# Altium project F407ULPI&externalDAC.PrjPcb
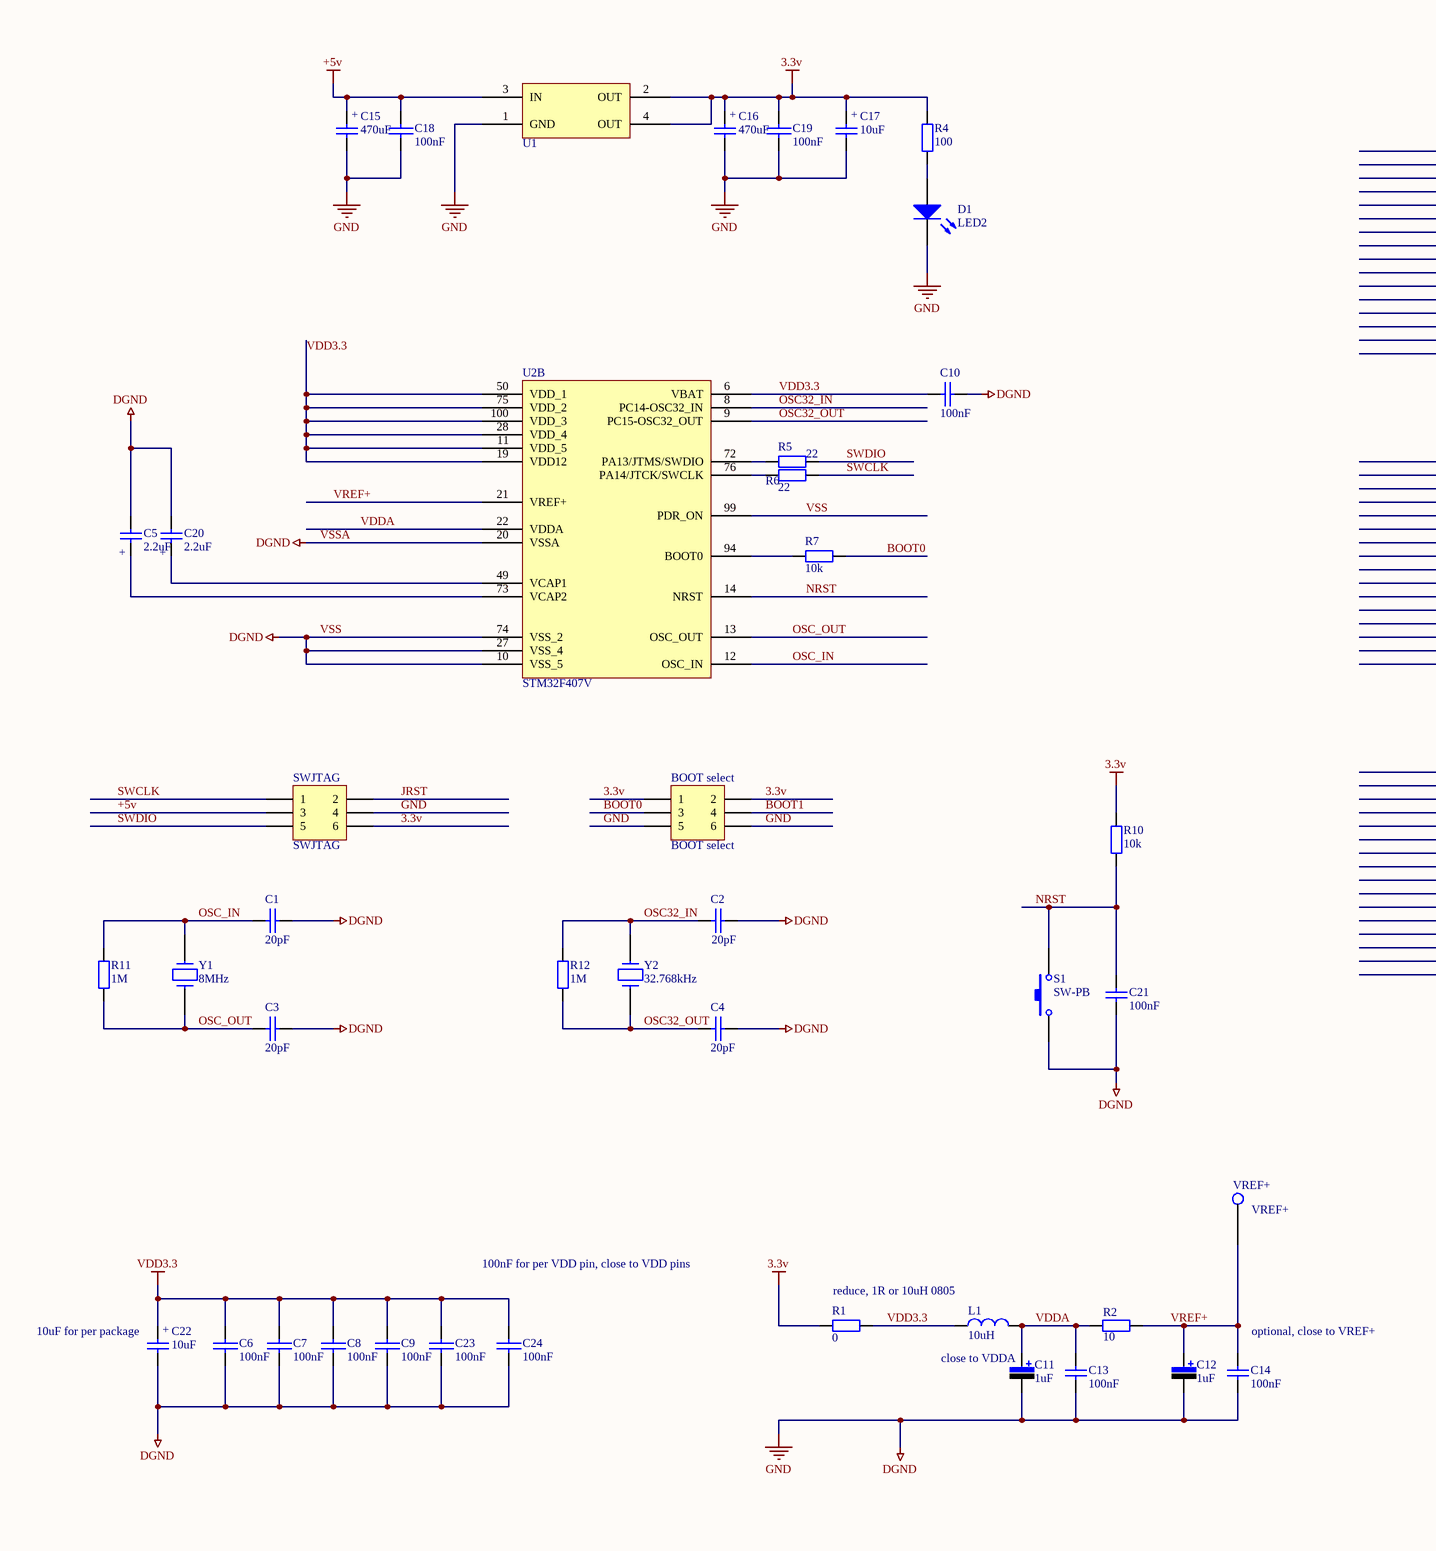
[diagram p0: F407ULPI&externalDAC.SchDoc, left]
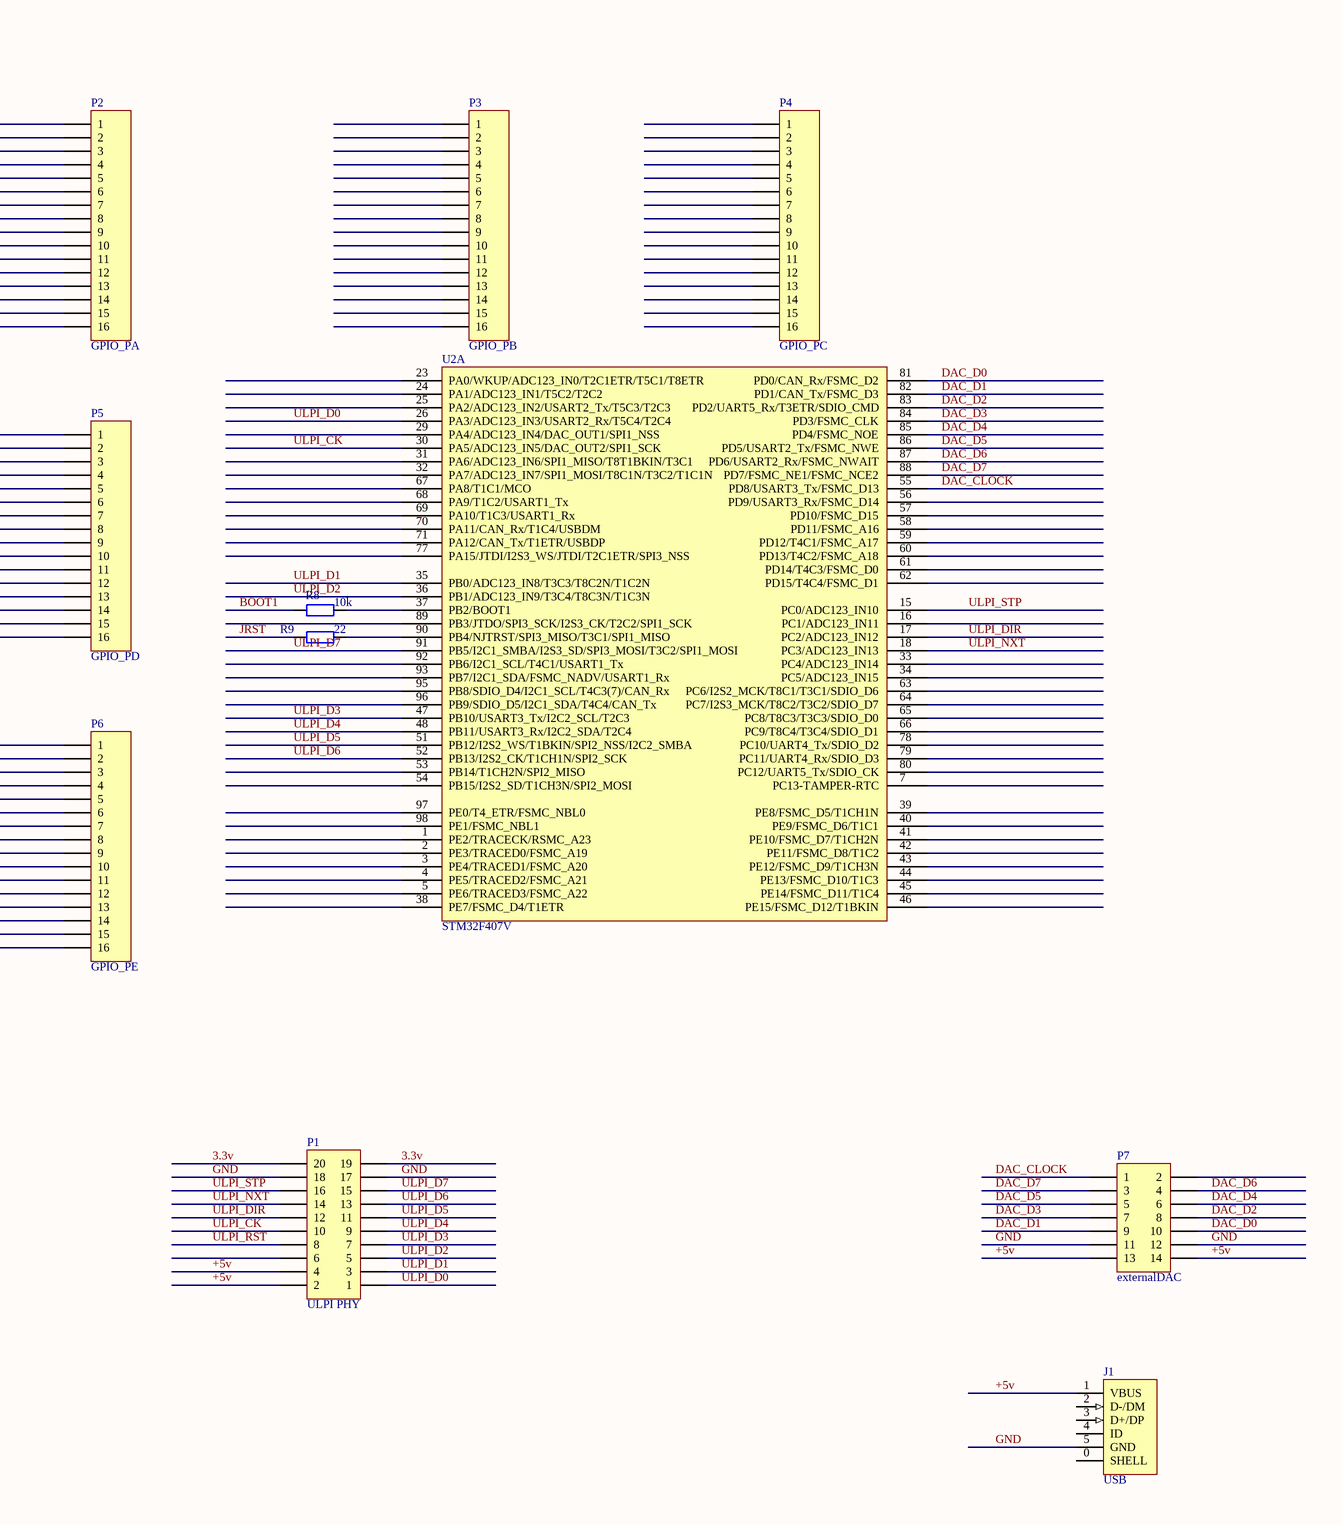
[diagram p1: F407ULPI&externalDAC.SchDoc, right]
1 sheet, 53 parts. Net scope: global (net labels, ports and power ports of the same name join across sheets).
Board file: F407ULPI&externalDAC.PcbDoc

## Sheet F407ULPI&externalDAC.SchDoc
size A2; PageSetup: Record=PageOptions|CenterHorizontal=True|CenterVertical=True|PrintScale=1.00|XCorrection=1.00|YCorrection=1.00|PrintKind=1|BorderSize=5000000|LeftOffset=0|BottomOffset=0|Orientation=1|PaperLength=1000|PaperWidth=1000|Scale=100|PaperSource=7|PrintQuality=-3|MediaType=1|DitherType=10|PrintScaleMode=1|PaperKind=A4|PaperIndex=9

### Parts
BOOT_select  BOOT select  [HDR2X3_CEN]
C1  value 20pF  [CAP-0603]  (hidden comment: cap smd)
C2  value 20pF  [CAP-0603]  (hidden comment: cap smd)
C3  value 20pF  [CAP-0603]  (hidden comment: cap smd)
C4  value 20pF  [CAP-0603]  (hidden comment: cap smd)
C5  value 2.2uF  [CAP-3216]  (hidden comment: Cap)
C6  value 100nF  [CAP-0603]  (hidden comment: cap smd)
C7  value 100nF  [CAP-0603]  (hidden comment: cap smd)
C8  value 100nF  [CAP-0603]  (hidden comment: cap smd)
C9  value 100nF  [CAP-0603]  (hidden comment: cap smd)
C10  value 100nF  [CAP-0603]  (hidden comment: cap smd)
C11  value 1uF  [CAP-3216]  (hidden comment: Cap Pol)
C12  value 1uF  [CAP-3216]  (hidden comment: Cap Pol)
C13  value 100nF  [CAP-0603]  (hidden comment: Cap)
C14  value 100nF  [CAP-0603]  (hidden comment: Cap)
C15  value 470uF  [CAP-7343]  (hidden comment: Cap)
C16  value 470uF  [CAP-7343]  (hidden comment: Cap)
C17  value 10uF  [CAP-3216]  (hidden comment: Cap)
C18  value 100nF  [CAP-0603]  (hidden comment: cap smd)
C19  value 100nF  [CAP-0603]  (hidden comment: cap smd)
C20  value 2.2uF  [CAP-3216]  (hidden comment: Cap)
C21  value 100nF  [CAP-0603]  (hidden comment: Cap)
C22  value 10uF  [CAP-3216]  (hidden comment: Cap)
C23  value 100nF  [CAP-0603]  (hidden comment: cap smd)
C24  value 100nF  [CAP-0603]  (hidden comment: cap smd)
D1  LED2  [LED_0805]
J1  USB  [microUSB]
L1  value 10uH  [0805-1]  (hidden comment: Inductor)
P1  ULPI PHY  [HDR2X10]
P2  GPIO_PA  [HDR1X16]
P3  GPIO_PB  [HDR1X16]
P4  GPIO_PC  [HDR1X16]
P5  GPIO_PD  [HDR1X16]
P6  GPIO_PE  [HDR1X16]
P7  externalDAC  [HDR2X7]
R1  value 0  [CAP-0603]  (hidden comment: RES1)
R2  value 10  [CAP-0603]  (hidden comment: Res1)
R4  value 100  [CAP-0603]  (hidden comment: RES1)
R5  value 22  [CAP-0603]  (hidden comment: RES1)
R6  value 22  [CAP-0603]  (hidden comment: RES1)
R7  value 10k  [CAP-0603]  (hidden comment: RES1)
R8  value 10k  [CAP-0603]  (hidden comment: RES1)
R9  value 22  [CAP-0603]  (hidden comment: RES1)
R10  value 10k  [R2012[0805]]  (hidden comment: RES1)
R11  value 1M  [R2012[0805]]  (hidden comment: RES1)
R12  value 1M  [R2012[0805]]  (hidden comment: RES1)
S1  SW-PB  [SPST-2]
SWJTAG  SWJTAG  [HDR2X3_CEN]
U1  1117-3.3  [SOT223]  (value not drawn)
U2  STM32F407V  [LQFP-100_M]  (parts A,B of 2)
VREF+  VREF+  [HDR1*1]
Y1  8MHz  [Crystal]
Y2  32.768kHz  [Crystal]

### Nets
3.3v: BOOT_select.1 BOOT_select.2 C16.1(+) C17.1(+) C19.1 P1.19 P1.20 R1.1 R4.2 R10.2 SWJTAG.6 U1.2(OUT) U1.4(OUT)
+5v: C15.1(+) C18.1 J1.1(VBUS) P1.2 P1.4 P7.13 P7.14 SWJTAG.3 U1.3(IN)
GND: BOOT_select.5 BOOT_select.6 C1.2 C2.2 C3.1 C4.1 C5.2(-) C6.2 C7.2 C8.2 C9.2 C10.1 C11.2 C12.2 C13.1 C14.1 C15.2(-) C16.2(-) C17.2(-) C18.2 C19.2 C20.2(-) C21.1 C22.2(-) C23.2 C24.2 D1.2(K) J1.5(GND) P1.17 P1.18 P7.11 P7.12 S1.1 SWJTAG.4 U1.1(GND) U2.10(VSS_5) U2.20(VSSA) U2.27(VSS_4) U2.74(VSS_2) U2.99(PDR_ON)  [also labelled DGND, VSS, VSSA]
VDD3.3: C6.1 C7.1 C8.1 C9.1 C10.2 C22.1(+) C23.1 C24.1 L1.1 R1.2 U2.6(VBAT) U2.11(VDD_5) U2.19(VDD12) U2.28(VDD_4) U2.50(VDD_1) U2.75(VDD_2) U2.100(VDD_3)
BOOT0: BOOT_select.3 R7.2
BOOT1: BOOT_select.4 R8.1
DAC_CLOCK: P7.1 U2.55(PD8/USART3_Tx/FSMC_D13)
DAC_D0: P7.10 U2.81(PD0/CAN_Rx/FSMC_D2)
DAC_D1: P7.9 U2.82(PD1/CAN_Tx/FSMC_D3)
DAC_D2: P7.8 U2.83(PD2/UART5_Rx/T3ETR/SDIO_CMD)
DAC_D3: P7.7 U2.84(PD3/FSMC_CLK)
DAC_D4: P7.6 U2.85(PD4/FSMC_NOE)
DAC_D5: P7.5 U2.86(PD5/USART2_Tx/FSMC_NWE)
DAC_D6: P7.4 U2.87(PD6/USART2_Rx/FSMC_NWAIT)
DAC_D7: P7.3 U2.88(PD7/FSMC_NE1/FSMC_NCE2)
JRST: R9.1 SWJTAG.2
NRST: C21.2 R10.1 S1.2 U2.14(NRST)
OSC32_IN: C2.1 R12.2 U2.8(PC14-OSC32_IN) Y2.2
OSC32_OUT: C4.2 R12.1 U2.9(PC15-OSC32_OUT) Y2.1
OSC_IN: C1.1 R11.2 U2.12(OSC_IN) Y1.2
OSC_OUT: C3.2 R11.1 U2.13(OSC_OUT) Y1.1
SWCLK: R6.2 SWJTAG.1
SWDIO: R5.2 SWJTAG.5
ULPI_CK: P1.10 U2.30(PA5/ADC123_IN5/DAC_OUT2/SPI1_SCK)
ULPI_D0: P1.1 U2.26(PA3/ADC123_IN3/USART2_Rx/T5C4/T2C4)
ULPI_D1: P1.3 U2.35(PB0/ADC123_IN8/T3C3/T8C2N/T1C2N)
ULPI_D2: P1.5 U2.36(PB1/ADC123_IN9/T3C4/T8C3N/T1C3N)
ULPI_D3: P1.7 U2.47(PB10/USART3_Tx/I2C2_SCL/T2C3)
ULPI_D4: P1.9 U2.48(PB11/USART3_Rx/I2C2_SDA/T2C4)
ULPI_D5: P1.11 U2.51(PB12/I2S2_WS/T1BKIN/SPI2_NSS/I2C2_SMBA)
ULPI_D6: P1.13 U2.52(PB13/I2S2_CK/T1CH1N/SPI2_SCK)
ULPI_D7: P1.15 U2.91(PB5/I2C1_SMBA/I2S3_SD/SPI3_MOSI/T3C2/SPI1_MOSI)
ULPI_DIR: P1.12 U2.17(PC2/ADC123_IN12)
ULPI_NXT: P1.14 U2.18(PC3/ADC123_IN13)
ULPI_RST: P1.8
ULPI_STP: P1.16 U2.15(PC0/ADC123_IN10)
VDDA: C11.1 C13.2 L1.2 R2.1 U2.22(VDDA)
VREF+: C12.1 C14.2 R2.2 U2.21(VREF+) VREF+.1(p)
NetC5_1: C5.1(+) U2.73(VCAP2)
NetC20_1: C20.1(+) U2.49(VCAP1)
NetD1_1: D1.1(A) R4.1
NetR5_1: R5.1 U2.72(PA13/JTMS/SWDIO)
NetR6_1: R6.1 U2.76(PA14/JTCK/SWCLK)
NetR7_1: R7.1 U2.94(BOOT0)
NetR8_2: R8.2 U2.37(PB2/BOOT1)
NetR9_2: R9.2 U2.90(PB4/NJTRST/SPI3_MISO/T3C1/SPI1_MISO)

Not connected (* = marked no-connect by the designer): J1 0(SHELL) 2(D-/DM) 3(D+/DP) 4(ID); P1 6; P2 1 2 3 4 5 6 7 8 9 10 11 12 13 14 15 16; P3 1 2 3 4 5 6 7 8 9 10 11 12 13 14 15 16; P4 1 2 3 4 5 6 7 8 9 10 11 12 13 14 15 16; P5 1 2 3 4 5 6 7 8 9 10 11 12 13 14 15 16; P6 1 2 3 4 5 6 7 8 9 10 11 12 13 14 15 16; P7 2; U2 1(PE2/TRACECK/RSMC_A23) 2(PE3/TRACED0/FSMC_A19) 3(PE4/TRACED1/FSMC_A20) 4(PE5/TRACED2/FSMC_A21) 5(PE6/TRACED3/FSMC_A22) 7(PC13-TAMPER-RTC) 16(PC1/ADC123_IN11) 23(PA0/WKUP/ADC123_IN0/T2C1ETR/T5C1/T8ETR) 24(PA1/ADC123_IN1/T5C2/T2C2) 25(PA2/ADC123_IN2/USART2_Tx/T5C3/T2C3) 29(PA4/ADC123_IN4/DAC_OUT1/SPI1_NSS) 31(PA6/ADC123_IN6/SPI1_MISO/T8T1BKIN/T3C1) 32(PA7/ADC123_IN7/SPI1_MOSI/T8C1N/T3C2/T1C1N) 33(PC4/ADC123_IN14) 34(PC5/ADC123_IN15) 38(PE7/FSMC_D4/T1ETR) 39(PE8/FSMC_D5/T1CH1N) 40(PE9/FSMC_D6/T1C1) 41(PE10/FSMC_D7/T1CH2N) 42(PE11/FSMC_D8/T1C2) 43(PE12/FSMC_D9/T1CH3N) 44(PE13/FSMC_D10/T1C3) 45(PE14/FSMC_D11/T1C4) 46(PE15/FSMC_D12/T1BKIN) 53(PB14/T1CH2N/SPI2_MISO) 54(PB15/I2S2_SD/T1CH3N/SPI2_MOSI) 56(PD9/USART3_Rx/FSMC_D14) 57(PD10/FSMC_D15) 58(PD11/FSMC_A16) 59(PD12/T4C1/FSMC_A17) 60(PD13/T4C2/FSMC_A18) 61(PD14/T4C3/FSMC_D0) 62(PD15/T4C4/FSMC_D1) 63(PC6/I2S2_MCK/T8C1/T3C1/SDIO_D6) 64(PC7/I2S3_MCK/T8C2/T3C2/SDIO_D7) 65(PC8/T8C3/T3C3/SDIO_D0) 66(PC9/T8C4/T3C4/SDIO_D1) 67(PA8/T1C1/MCO) 68(PA9/T1C2/USART1_Tx) 69(PA10/T1C3/USART1_Rx) 70(PA11/CAN_Rx/T1C4/USBDM) 71(PA12/CAN_Tx/T1ETR/USBDP) 77(PA15/JTDI/I2S3_WS/JTDI/T2C1ETR/SPI3_NSS) 78(PC10/UART4_Tx/SDIO_D2) 79(PC11/UART4_Rx/SDIO_D3) 80(PC12/UART5_Tx/SDIO_CK) 89(PB3/JTDO/SPI3_SCK/I2S3_CK/T2C2/SPI1_SCK) 92(PB6/I2C1_SCL/T4C1/USART1_Tx) 93(PB7/I2C1_SDA/FSMC_NADV/USART1_Rx) 95(PB8/SDIO_D4/I2C1_SCL/T4C3(7)/CAN_Rx) 96(PB9/SDIO_D5/I2C1_SDA/T4C4/CAN_Tx) 97(PE0/T4_ETR/FSMC_NBL0) 98(PE1/FSMC_NBL1)

### Notes on the sheet
- 100nF for per VDD pin, close to VDD pins
- reduce, 1R or 10uH 0805
- (near C22) 10uF for per package
- (near C11) close to VDDA
- (near C14) optional, close to VREF+

### Library data of the parts
BOOT_select SWJTAG = Header 3X2: Header, 3-Pin, Dual row; LatestRevisionDate: 17-Jul-2002; LatestRevisionNote: Re-released for DXP Platform.; Publisher: Altium Limited
C1-C4 C6-C10 C18 C19 C23 C24 = CAP: 贴片无极性电容
C5 C15-C17 C20 C22 = Cap Pol S: 贴片极性电容
C11 C12 = Cap Pol: 极性电解电容; Vol: 16V; Published: 8-Jun-2000; LatestRevisionDate: 17-Jul-2002; LatestRevisionNote: Re-released for DXP Platform.; PackageReference: RB7.6-15; Publisher: Altium Limited
C13 C14 C21 = Cap: 无极性电容; Published: 8-Jun-2000; LatestRevisionDate: 17-Jul-2002; LatestRevisionNote: Re-released for DXP Platform.; PackageReference: RAD-0.3; Publisher: Altium Limited
D1 = LED2: Typical RED, GREEN, YELLOW, AMBER GaAs LED; Published: 8-Jun-2000; LatestRevisionDate: 17-Jul-2002; LatestRevisionNote: Re-released for DXP Platform.; PackageDocument: Feb-2002; PackageReference: 3.2X1.6X1.1; Publisher: Altium Limited
J1 = Micro_USB: USB 2.0, Right Angle, SMT, B Type, Receptacle, 5 Position, Black; ContactMaterial: Copper Alloy; ContactPlating: Gold (30); PCB_Layout: Complies with manufacturer's recommendation.; DrillSize: Corresponds to nominal value.; PanelGround: Without; Published: 15-Jul-2004; DatasheetDocument: 27-Jun-2003; PackageDocument: 27-Jun-2003; PackageReference: 440247; Publisher: Altium Limited; HousingMaterial: Thermoplastic; ComponentLink1Description: Manufacturer Link; ComponentLink1URL: http://www.tycoelectronics.com/; ComponentLink2Description: Packaging Specification; ComponentLink2URL: http://ecommas.tycoelectronics.com/commerce/DocumentDelivery/DDEController?Action=showdoc&DocId=Customer+Drawing%7F440247%7FD%7Fpdf%7FEnglish%7FC_440247_D.pdf
L1 = Inductor: 电感; Code_IEC: 1005; Published: 8-Jun-2000; LatestRevisionDate: 17-Jul-2002; LatestRevisionNote: Re-released for DXP Platform.; PackageReference: 0402-A; Publisher: Altium Limited; Code_JEITA: 0402
P1 = MHDR2X10: Header, 10-Pin, Dual row; LatestRevisionDate: 17-Jul-2002; LatestRevisionNote: Re-released for DXP Platform.; Publisher: Altium Limited
P2-P6 = Header 16: Header, 16-Pin; LatestRevisionDate: 17-Jul-2002; LatestRevisionNote: Re-released for DXP Platform.; Publisher: Altium Limited
P7 = Header 7X2: Header, 7-Pin, Dual row; LatestRevisionDate: 17-Jul-2002; LatestRevisionNote: Re-released for DXP Platform.; Publisher: Altium Limited
R2 = Res1: 贴片电阻; Published: 8-Jun-2000; LatestRevisionDate: 17-Jul-2002; LatestRevisionNote: Re-released for DXP Platform.; PackageReference: AXIAL-0.4; Publisher: Altium Limited
S1 = SW-PB: Switch; Published: 24-Mar-1999; LatestRevisionDate: 17-Jul-2002; LatestRevisionNote: Re-released for DXP Platform.; PackageReference: SPST-2; Publisher: Altium Limited
U2 = STM32F407V: STM32单片机100引脚
VREF+ = Header 1
Y1 Y2 = CRYSTAL